# Altium schematic sheet 10-Power.SchDoc
size A4
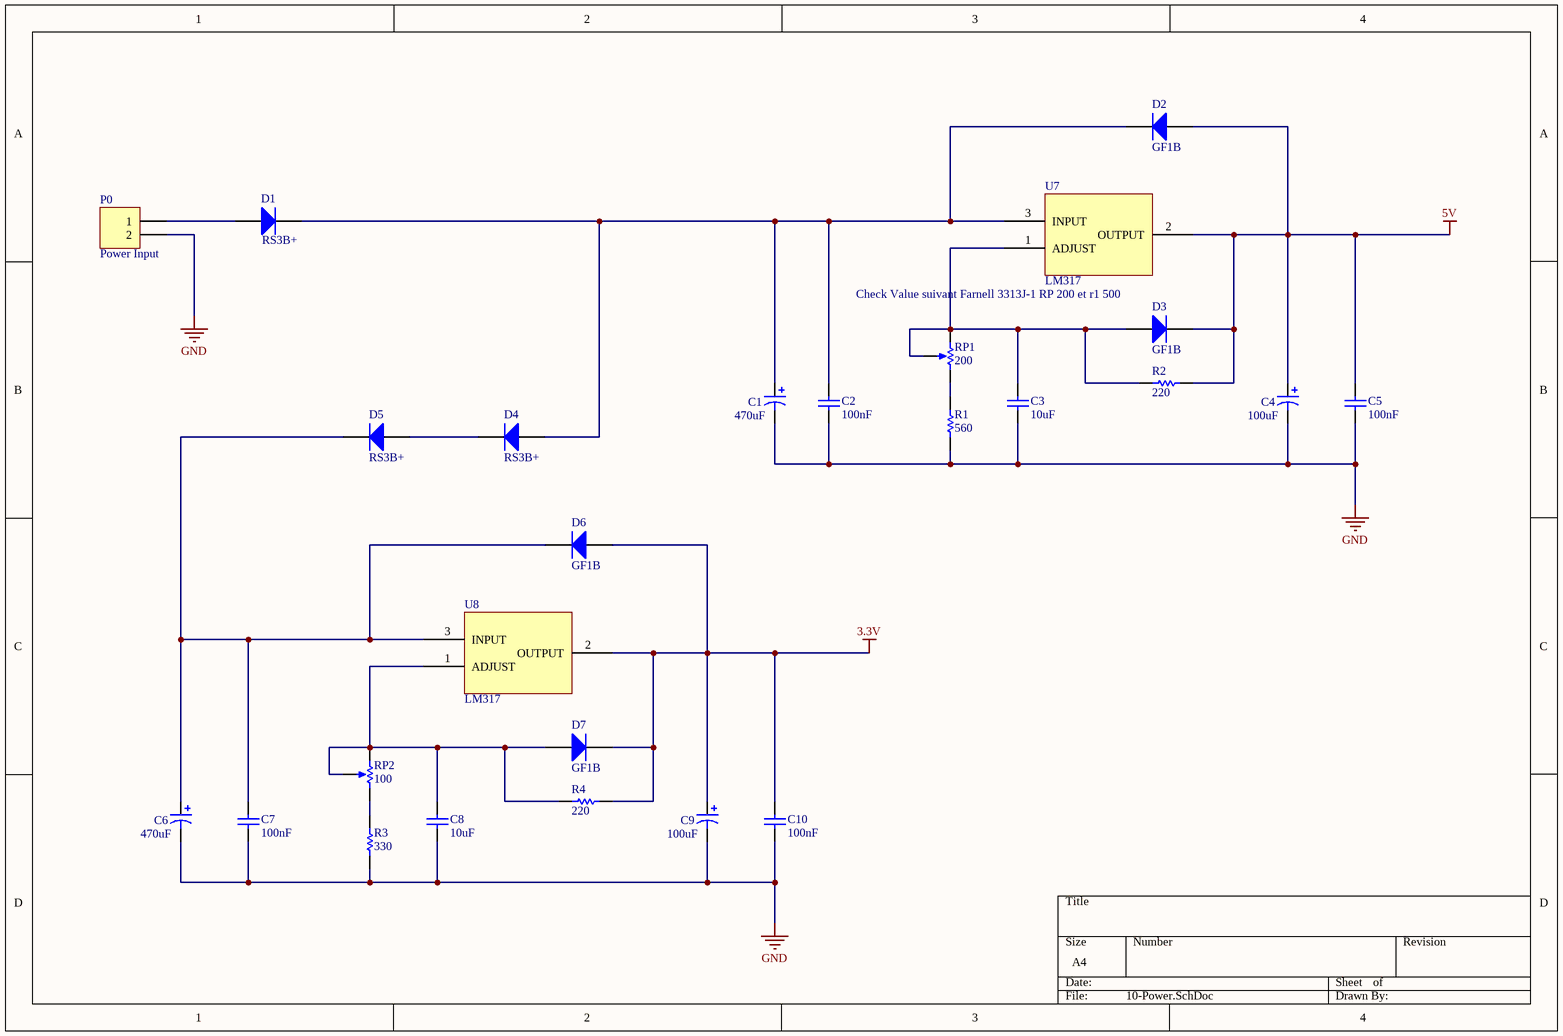
[diagram p0: 10-Power.SchDoc]

## Parts
C1  470uF  [CAPA PANA SIZE D*]
C2  100nF  [capa 1206]
C3  10uF  [capa 1206]
C4  100uF  [CAPA PANA SIZE D*]
C5  100nF  [capa 1206]
C6  470uF  [CAPA PANA SIZE D*]
C7  100nF  [capa 1206]
C8  10uF  [capa 1206]
C9  100uF  [CAPA PANA SIZE D*]
C10  100nF  [capa 1206]
D1  RS3B+  [SMC Vishay]
D2  GF1B  [DO-214AC(SMA)]
D3  GF1B  [DO-214AC(SMA)]
D4  RS3B+  [SMC Vishay]
D5  RS3B+  [SMC Vishay]
D6  GF1B  [DO-214AC(SMA)]
D7  GF1B  [DO-214AC(SMA)]
P0  Power Input  [PWR]
R1  560  [RES 1206]
R2  220  [RES 1206]
R3  330  [RES 1206]
R4  220  [RES 1206]
RP1  200  [3313J-1]
RP2  100  [3313J-1]
U7  LM317  [D2PAK]
U8  LM317  [D2PAK]

## Nets
3.3V: C9.1 C10.2 D6.1(A) D7.2(K) R4.1 U8.2(OUTPUT)
5V: C4.1 C5.2 D2.1(A) D3.2(K) R2.1 U7.2(OUTPUT)
GND: C1.2 C2.1 C3.1 C4.2 C5.1 C6.2 C7.1 C8.1 C9.2 C10.1 P0.2 R1.1 R3.2
NetC1_1: C1.1 C2.2 D1.2(K) D2.2(K) D4.1(A) U7.3(INPUT)
NetC3_2: C3.2 D3.1(A) R2.2 RP1.1(TOP) RP1.3(TAP) U7.1(ADJUST)
NetC6_1: C6.1 C7.2 D5.2(K) D6.2(K) U8.3(INPUT)
NetC8_2: C8.2 D7.1(A) R4.2 RP2.1(TOP) RP2.3(TAP) U8.1(ADJUST)
NetD1_1: D1.1(A) P0.1
NetD4_2: D4.2(K) D5.1(A)
NetR1_2: R1.2 RP1.2(BOT)
NetR3_1: R3.1 RP2.2(BOT)

## Notes on the sheet
- Check Value suivant Farnell 3313J-1 RP 200 et r1 500

## Library data of the parts
C1 C6 = Cap Pol1: Polarized Capacitor (Radial); Fabricant: PANASONIC; Fournisseur: Farnell; RefFabricant: EEEFTA471XAP; RefFournisseur: 2065963
C2 C5 C7 C10 = Cap: Capacitor; Fabricant: MULTICOMP; Fournisseur: Farnell; RefFabricant: MC1206B104K500CT; RefFournisseur: 1759361
C3 C8 = Cap: Capacitor; Fabricant: MULTICOMP; Fournisseur: Farnell; RefFabricant: MC1206X106K160CT; RefFournisseur: 2320922
C4 C9 = Cap Pol1: Polarized Capacitor (Radial); Fabricant: PANASONIC; Fournisseur: Farnell; RefFabricant: EEE1AA101SP; RefFournisseur: 2326098
D1 D4 D5 = Diode: Default Diode; Fabricant: MULTICOMP; Fournisseur: Farnell; RefFournisseur: 2675034RL; RefFabricant: RS3B+
D2 D3 D6 D7 = Diode: Default Diode; Fabricant: FAIRCHILD SEMICONDUCTOR; Fournisseur: Farnell; RefFournisseur: 1467477; RefFabricant: GF1B
P0 = Header 2: Header, 2-Pin; Fabricant: N/A; Fournisseur: N/A; RefFabricant: N/A; RefFournisseur: N/A
R1 = Res1: Resistor; Fabricant: MULTICOMP; Fournisseur: Farnell; RefFabricant: MC0125W12065560R; RefFournisseur: 9337490
R2 R4 = Res1: Resistor; Fabricant: MULTICOMP; Fournisseur: Farnell; RefFabricant: MC0125W12065220R; RefFournisseur: 9337210
R3 = Res1: Resistor; Fabricant: MULTICOMP; Fournisseur: Farnell; RefFabricant: MC0125W12065330R; RefFournisseur: 9337326
RP1 = RPot: Potentiometer; Fabricant: BOURNS; Fournisseur: Farnell; RefFabricant: 3313J-1-201E; RefFournisseur: 2336460
RP2 = RPot: Potentiometer; Fabricant: BOURNS; Fournisseur: Farnell; RefFabricant: 3313J-1-101E; RefFournisseur: 2321829
U7 U8 = LM317: Fabricant: ON SEMICONDUCTOR; Fournisseur: Farnell; RefFabricant: LM317D2T-TR; RefFournisseur: 1564300